# EAGLE schematic A-FINAL_SCHEMATIC (EAGLE 9.6.2)
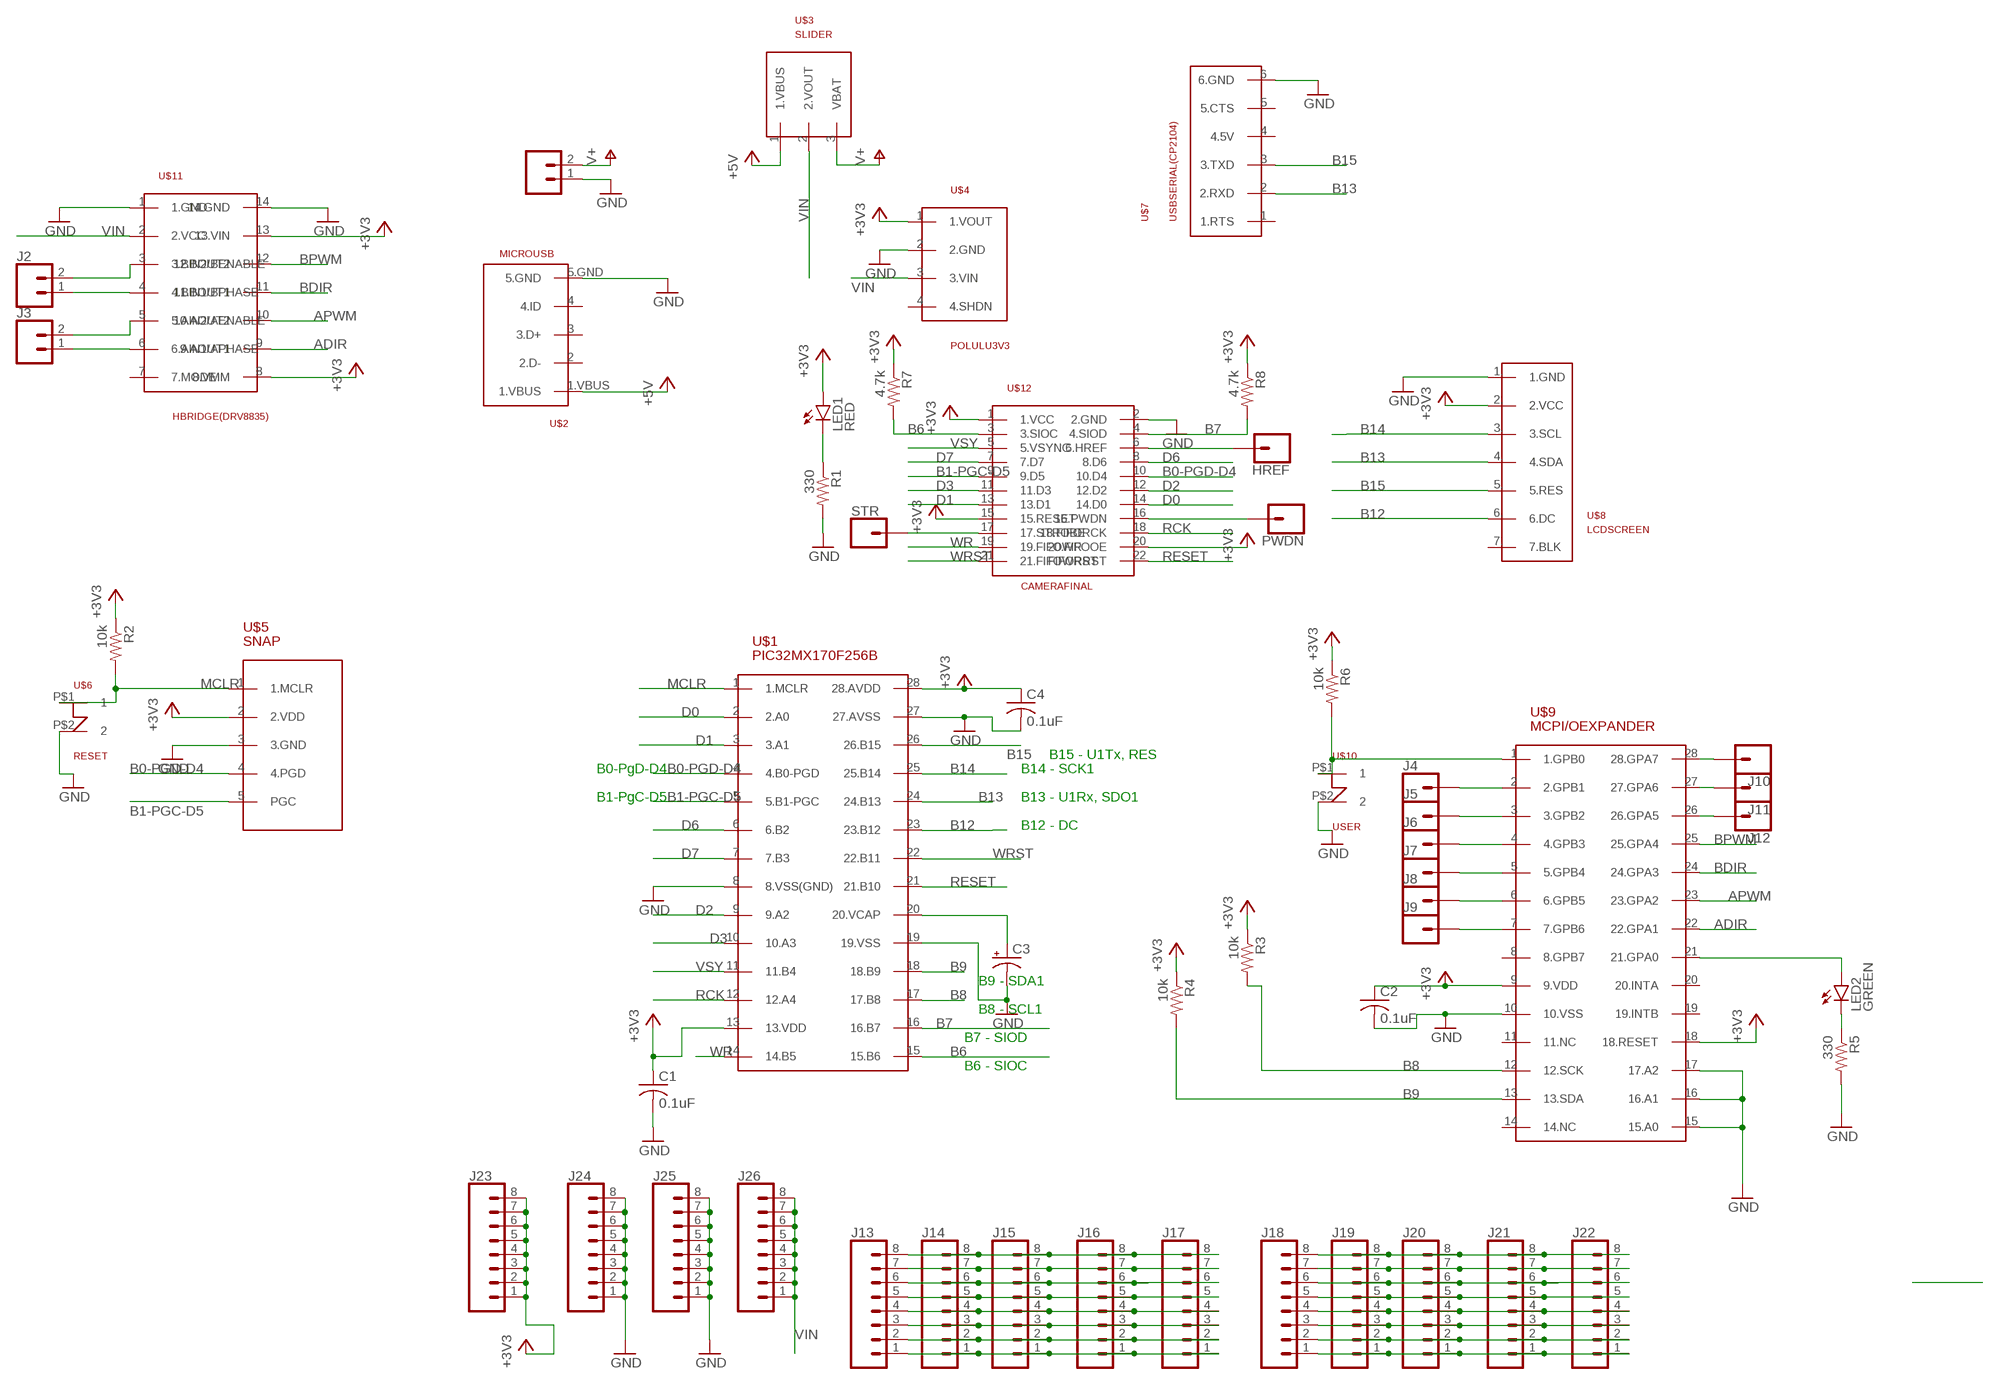
[diagram p0: schematic, sheet 1]

## Parts
C1  0.1uF  C-US025-030X050  [C025-030X050]
C2  0.1uF  C-US025-030X050  [C025-030X050]
C3  CPOL-USB45181B  [B45181B]
C4  0.1uF  C-US025-030X050  [C025-030X050]
HREF  CONN_01  [1X01]
J1  CONN_02-JST-2-PTH-NO_SILK  [JST-2-PTH-NS]
J2  CONN_02  [1X02]
J3  CONN_02  [1X02]
J4  CONN_01  [1X01]
J5  CONN_01  [1X01]
J6  CONN_01  [1X01]
J7  CONN_01  [1X01]
J8  CONN_01  [1X01]
J9  CONN_01  [1X01]
J10  CONN_01  [1X01]
J11  CONN_01  [1X01]
J12  CONN_01  [1X01]
J13  CONN_08"  [1X08]
J14  CONN_08"  [1X08]
J15  CONN_08"  [1X08]
J16  CONN_08"  [1X08]
J17  CONN_08"  [1X08]
J18  CONN_08"  [1X08]
J19  CONN_08"  [1X08]
J20  CONN_08"  [1X08]
J21  CONN_08"  [1X08]
J22  CONN_08"  [1X08]
J23  CONN_08"  [1X08]
J24  CONN_08"  [1X08]
J25  CONN_08"  [1X08]
J26  CONN_08"  [1X08]
LED1  RED  LED3MM  [LED3MM]
LED2  GREEN  LED3MM  [LED3MM]
PWDN  CONN_01  [1X01]
R1  330  R-US_0207/10  [0207/10]
R2  10k  R-US_0207/10  [0207/10]
R3  10k  R-US_0207/10  [0207/10]
R4  10k  R-US_0207/10  [0207/10]
R5  330  R-US_0207/10  [0207/10]
R6  10k  R-US_0207/10  [0207/10]
R7  4.7k  R-US_0207/10  [0207/10]
R8  4.7k  R-US_0207/10  [0207/10]
STR  CONN_01  [1X01]
U$1  PIC32MX170F256B  [DIL28-3]
U$2  MICROUSB  [MICROUSB]
U$3  SLIDER  [SLIDE]
U$4  POLULU3V3  [POLULU3V3]
U$5  SNAP  [1X05]
U$6  RESET  PUSH  [PUSH]
U$7  USBSERIAL(CP2104)  [USBSERIAL(CP2104)]
U$8  LCDSCREEN  [LCDSCREEN]
U$9  MCPI/OEXPANDER  [MCPI/OEXPANDER]
U$10  USER  PUSH  [PUSH]
U$11  HBRIDGE(DRV8835)  [HBRIDGE(DRV8835)]
U$12  CAMERAFINAL  [CAMERA_FINAL]

## Nets
+3V3: C1.1 C2.1 C4.1 J23.1 J23.2 J23.3 J23.4 J23.5 J23.6 J23.7 J23.8 LED1.A R2.1 R3.1 R4.1 R6.1 R7.1 R8.1 U$1.13(13.VDD) U$1.28(28.AVDD) U$4.1(1.VOUT) U$5.2(2.VDD) U$8.2.(2.VCC) U$9.9(9.VDD) U$9.18(18.RESET) U$11.8(8.VMM) U$11.13(13.VIN) U$12.1(1.VCC) U$12.15(15.RESET) U$12.20(20.FIFOOE)
+5V: U$2.1.VBUS U$3.1(1.VBUS)
ADIR: U$9.22(22.GPA1) U$11.9(9.AOUT1)
APWM: U$9.23(23.GPA2) U$11.10(10.AOUT2)
B0-PGD-D4: U$1.4(4.B0-PGD) U$5.4(4.PGD) U$12.10(10.D4)
B1-PGC-D5: U$1.5(5.B1-PGC) U$5.5(PGC) U$12.9(9.D5)
B6: R7.2 U$1.15(15.B6) U$12.3(3.SIOC)
B7: R8.2 U$1.16(16.B7) U$12.4(4.SIOD)
B8: R3.2 U$1.17(17.B8) U$9.12(12.SCK)
B9: R4.2 U$1.18(18.B9) U$9.13(13.SDA)
B12: U$1.23(23.B12) U$8.6.(6.DC)
B13: U$1.24(24.B13) U$7.2(2.RXD) U$8.4.(4.SDA)
B14: U$1.25(25.B14) U$8.3.(3.SCL)
B15: U$1.26(26.B15) U$7.3(3.TXD) U$8.5.(5.RES)
BDIR: U$9.24(24.GPA3) U$11.11(11.BOUT1)
BPWM: U$9.25(25.GPA4) U$11.12(12.BOUT2)
D0: U$1.2(2.A0) U$12.14(14.D0)
D1: U$1.3(3.A1) U$12.13(13.D1)
D2: U$1.9(9.A2) U$12.12(12.D2)
D3: U$1.10(10.A3) U$12.11(11.D3)
D6: U$1.6(6.B2) U$12.8(8.D6)
D7: U$1.7(7.B3) U$12.7(7.D7)
GND: C1.2 C2.2 C3.- C4.2 J1.1 J24.1 J24.2 J24.3 J24.4 J24.5 J24.6 J24.7 J24.8 J25.1 J25.2 J25.3 J25.4 J25.5 J25.6 J25.7 J25.8 R1.2 R5.2 U$1.8(8.VSS(GND)) U$1.19(19.VSS) U$1.27(27.AVSS) U$2.5.GND U$4.2(2.GND) U$5.3(3.GND) U$6.P$2 U$7.6(6.GND) U$8.1.(1.GND) U$9.10(10.VSS) U$9.15(15.A0) U$9.16(16.A1) U$9.17(17.A2) U$10.P$2 U$11.1(1.GND) U$11.14(14.GND) U$12.2(2.GND)
MCLR: R2.2 U$1.1(1.MCLR) U$5.1(1.MCLR) U$6.P$1
N$1: LED1.K(C) R1.1
N$2: LED2.A U$9.21(21.GPA0)
N$3: C3.+ U$1.20(20.VCAP)
N$4: LED2.K(C) R5.1
N$5: R6.2 U$9.1(1.GPB0) U$10.P$1
N$6: J2.2 U$11.3(3.BIN2/BENABLE)
N$7: J2.1 U$11.4(4.BIN1/BPHASE)
N$8: J3.2 U$11.5(5.AIN2/AENABLE)
N$9: J3.1 U$11.6(6.AIN1/APHASE)
N$10: HREF.1 U$12.6(6.HREF)
N$11: PWDN.1 U$12.16(16.PWDN)
N$12: STR.1 U$12.17(17.STROBE)
N$13: J4.1 U$9.2(2.GPB1)
N$14: J5.1 U$9.3(3.GPB2)
N$15: J6.1 U$9.4(4.GPB3)
N$16: J7.1 U$9.5(5.GPB4)
N$17: J8.1 U$9.6(6.GPB5)
N$18: J9.1 U$9.7(7.GPB6)
N$19: J10.1 U$9.28(28.GPA7)
N$20: J11.1 U$9.27(27.GPA6)
N$21: J12.1 U$9.26(26.GPA5)
N$22: J18.8 J19.8 J20.8 J21.8 J22.8
N$23: J13.8 J14.8 J15.8 J16.8 J17.8
N$24: J18.7 J19.7 J20.7 J21.7 J22.7
N$25: J18.6 J19.6 J20.6 J21.6 J22.6
N$26: J18.5 J19.5 J20.5 J21.5 J22.5
N$27: J18.4 J19.4 J20.4 J21.4 J22.4
N$28: J18.3 J19.3 J20.3 J21.3 J22.3
N$29: J18.2 J19.2 J20.2 J21.2 J22.2
N$30: J18.1 J19.1 J20.1 J21.1 J22.1
N$31: J13.7 J14.7 J15.7 J16.7 J17.7
N$32: J13.6 J14.6 J15.6 J16.6 J17.6
N$33: J13.5 J14.5 J15.5 J16.5 J17.5
N$34: J13.4 J14.4 J15.4 J16.4 J17.4
N$35: J13.3 J14.3 J15.3 J16.3 J17.3
N$36: J13.2 J14.2 J15.2 J16.2 J17.2
N$37: J13.1 J14.1 J15.1 J16.1 J17.1
RCK: U$1.12(12.A4) U$12.18(18.FIFORCK)
RESET: U$1.21(21.B10) U$12.22(FIFORRST)
V+: J1.2 U$3.3(VBAT)
VIN: J26.1 J26.2 J26.3 J26.4 J26.5 J26.6 J26.7 J26.8 U$3.2(2.VOUT) U$4.3(3.VIN) U$11.2(2.VCC)
VSY: U$1.11(11.B4) U$12.5(5.VSYNC)
WR: U$1.14(14.B5) U$12.19(19.FIFOWR)
WRST: U$1.22(22.B11) U$12.21(21.FIFOWRST)
Unconnected: U$2.2(2.D-) U$2.3(3.D+) U$2.4(4.ID) U$4.4(4.SHDN) U$7.1(1.RTS) U$7.4(4.5V) U$7.5(5.CTS) U$8.7.(7.BLK) U$9.8(8.GPB7) U$9.11(11.NC) U$9.14(14.NC) U$9.19(19.INTB) U$9.20(20.INTA) U$11.7(7.MODE)

## Notes on the sheet
- B15 - U1Tx, RES
- B0-PgD-D4 | B14 - SCK1
- B1-PgC-D5 | B13 - U1Rx, SDO1
- B12 - DC
- B9 - SDA1
- B8 - SCL1
- B7 - SIOD
- B6 - SIOC

## Library data of the parts
C1 C2 C4 = LIBRARY:C-US: CAPACITOR, American symbol; SPICEPREFIX: C
C3 = rcl:CPOL-US: POLARIZED CAPACITOR, American symbol; SPICEPREFIX: C
HREF J4-J12 PWDN STR = LIBRARY:CONN_01: Single connection point. Often used as Generic Header-pin footprint for 0.1 inch spaced/style header connections On any of the 0.1 inch spaced packages, you can populate with these: Break Away Headers - Straight <https://www.sparkfun.com/products/116> (PRT-00116) Break Away Male Headers - Right Angle <https://www.sparkfun.com/products/553> (PRT-00553) Female Headers <https://www.sparkfun.com/products/115> (PRT-00115) Break Away Headers - Machine Pin <https://www.sparkfun.com/products/117> (PRT-00117) Break Away Female Headers - Swiss Machine Pin <https://www.sparkfun.com/products/743> (PRT-00743) This device is also useful as a general connection point to wire up your design to another part of your project. Our various solder wires solder well into these plated through hole pads. Hook-Up Wire - Assortment (Stranded, 22 AWG) <https://www.sparkfun.com/products/11375> (PRT-11375) Hook-Up Wire - Assortment (Solid Core, 22 AWG) <https://www.sparkfun.com/products/11367> (PRT-11367) View the entire wire category on our website here <https://www.sparkfun.com/categories/141> Special notes: SMTSO-256-ET is a "flush mount" nut for a 4-40 screw. We mostly use this on specialty testbeds; it is a nice way to connect hardware to your PCB at an adjustable hieght. Also note, the SNAP packages are for using a snappable style connector. We sell a baggie of snaps and they are also used on two LilyPad designs: Snap Assortment - 30 pack (male and female) <https://www.sparkfun.com/products/11347> (DEV-11347) LilyPad Arduino SimpleSnap <https://www.sparkfun.com/products/10941> (DEV-10941) LilyPad SimpleSnap Protoboard <https://www.sparkfun.com/products/10940> (DEV-10940)
J1-J3 = LIBRARY:CONN_02: Multi connection point. Often used as Generic Header-pin footprint for 0.1 inch spaced/style header connections On any of the 0.1 inch spaced packages, you can populate with these: Break Away Headers - Straight <https://www.sparkfun.com/products/116> (PRT-00116) Break Away Male Headers - Right Angle <https://www.sparkfun.com/products/553> (PRT-00553) Female Headers <https://www.sparkfun.com/products/115> (PRT-00115) Break Away Headers - Machine Pin <https://www.sparkfun.com/products/117> (PRT-00117) Break Away Female Headers - Swiss Machine Pin <https://www.sparkfun.com/products/743> (PRT-00743) For SCREWTERMINALS and SPRING TERMINALS visit here: Screw Terimnals on SparkFun.com <https://www.sparkfun.com/search/results?term=Screw+Terminals> (5mm/3.5mm/2.54mm spacing) This device is also useful as a general connection point to wire up your design to another part of your project. Our various solder wires solder well into these plated through hole pads. Hook-Up Wire - Assortment (Stranded, 22 AWG) <https://www.sparkfun.com/products/11375> (PRT-11375) Hook-Up Wire - Assortment (Solid Core, 22 AWG) <https://www.sparkfun.com/products/11367> (PRT-11367) View the entire wire category on our website here <https://www.sparkfun.com/categories/141> Special notes: Molex polarized connector foot print use with: PRT-08233 with associated crimp pins and housings. 2.54_SCREWTERM for use with PRT-10571. 3.5mm Screw Terminal footprints for PRT-08084 5mm Screw Terminal footprints for use with PRT-08432
J13-J26 = LIBRARY:CONN_08: Multi connection point. Often used as Generic Header-pin footprint for 0.1 inch spaced/style header connections On any of the 0.1 inch spaced packages, you can populate with these: Break Away Headers - Straight <https://www.sparkfun.com/products/116> (PRT-00116) Break Away Male Headers - Right Angle <https://www.sparkfun.com/products/553> (PRT-00553) Female Headers <https://www.sparkfun.com/products/115> (PRT-00115) Break Away Headers - Machine Pin <https://www.sparkfun.com/products/117> (PRT-00117) Break Away Female Headers - Swiss Machine Pin <https://www.sparkfun.com/products/743> (PRT-00743) Arduino Stackable Header - 8 Pin <https://www.sparkfun.com/products/9279> (PRT-09279) For SCREWTERMINALS and SPRING TERMINALS visit here: Screw Terimnals on SparkFun.com <https://www.sparkfun.com/search/results?term=Screw+Terminals> (5mm/3.5mm/2.54mm spacing) This device is also useful as a general connection point to wire up your design to another part of your project. Our various solder wires solder well into these plated through hole pads. Hook-Up Wire - Assortment (Stranded, 22 AWG) <https://www.sparkfun.com/products/11375> (PRT-11375) Hook-Up Wire - Assortment (Solid Core, 22 AWG) <https://www.sparkfun.com/products/11367> (PRT-11367) View the entire wire category on our website here <https://www.sparkfun.com/categories/141> Special notes: Molex polarized connector foot print use with SKU : PRT-08231 with associated crimp pins and housings. 1MM SMD Version SKU: PRT-10208 NOTES ON THE VARIANTS LOCK and LOCK_LONGPADS... This footprint was designed to help hold the alignment of a through-hole component (i.e. 6-pin header) while soldering it into place. You may notice that each hole has been shifted either up or down by 0.005 of an inch from it's more standard position (which is a perfectly straight line). This slight alteration caused the pins (the squares in the middle) to touch the edges of the holes. Because they are alternating, it causes a "brace" to hold the component in place. 0.005 has proven to be the perfect amount of "off-center" position when using our standard breakaway headers. Although looks a little odd when you look at the bare footprint, once you have a header in there, the alteration is very hard to notice. Also,if you push a header all the way into place, it is covered up entirely on the bottom side.; PROD_ID: CONN-08438
LED1 LED2 = LIBRARY:LED: LED OSRAM: - CHIPLED LG R971, LG N971, LY N971, LG Q971, LY Q971, LO R971, LY R971 LH N974, LH R974 LS Q976, LO Q976, LY Q976 LO Q996 - Hyper CHIPLED LW Q18S LB Q993, LB Q99A, LB R99A - SideLED LS A670, LO A670, LY A670, LG A670, LP A670 LB A673, LV A673, LT A673, LW A673 LH A674 LY A675 LS A676, LA A676, LO A676, LY A676, LW A676 LS A679, LY A679, LG A679 - Hyper Micro SIDELED® LS Y876, LA Y876, LO Y876, LY Y876 LT Y87S - SmartLED LW L88C, LW L88S LB L89C, LB L89S, LG L890 LS L89K, LO L89K, LY L89K LS L896, LA L896, LO L896, LY L896 - TOPLED LS T670, LO T670, LY T670, LG T670, LP T670 LSG T670, LSP T670, LSY T670, LOP T670, LYG T670 LG T671, LOG T671, LSG T671 LB T673, LV T673, LT T673, LW T673 LH T674 LS T676, LA T676, LO T676, LY T676, LB T676, LH T676, LSB T676, LW T676 LB T67C, LV T67C, LT T67C, LS T67K, LO T67K, LY T67K, LW E67C LS E67B, LA E67B, LO E67B, LY E67B, LB E67C, LV E67C, LT E67C LW T67C LS T679, LY T679, LG T679 LS T770, LO T770, LY T770, LG T770, LP T770 LB T773, LV T773, LT T773, LW T773 LH T774 LS E675, LA E675, LY E675, LS T675 LS T776, LA T776, LO T776, LY T776, LB T776 LHGB T686 LT T68C, LB T68C - Hyper Mini TOPLED® LB M676 - Mini TOPLED Santana® LG M470 LS M47K, LO M47K, LY M47K Source: http://www.osram.convergy.de LUXEON: - LUMILED® LXK2-PW12-R00, LXK2-PW12-S00, LXK2-PW14-U00, LXK2-PW14-V00 LXK2-PM12-R00, LXK2-PM12-S00, LXK2-PM14-U00 LXK2-PE12-Q00, LXK2-PE12-R00, LXK2-PE12-S00, LXK2-PE14-T00, LXK2-PE14-U00 LXK2-PB12-K00, LXK2-PB12-L00, LXK2-PB12-M00, LXK2-PB14-N00, LXK2-PB14-P00, LXK2-PB14-Q00 LXK2-PR12-L00, LXK2-PR12-M00, LXK2-PR14-Q00, LXK2-PR14-R00 LXK2-PD12-Q00, LXK2-PD12-R00, LXK2-PD12-S00 LXK2-PH12-R00, LXK2-PH12-S00 LXK2-PL12-P00, LXK2-PL12-Q00, LXK2-PL12-R00 Source: www.luxeon.com KINGBRIGHT: KA-3528ASYC Source: www.kingbright.com
R1-R8 = LIBRARY:R-US_: RESISTOR, American symbol; SPICEPREFIX: R
U$1 = LIBRARY:PIC32MX170F256B
U$2 = LIBRARY:MICROUSB
U$3 = LIBRARY:SLIDER
U$4 = LIBRARY:POLULU3V3
U$5 = LIBRARY:SNAP
U$6 U$10 = LIBRARY:PUSH
U$7 = LIBRARY:USBSERIAL(CP2104)
U$8 = LIBRARY:LCDSCREEN
U$9 = LIBRARY:MCPI/OEXPANDER
U$11 = LIBRARY:HBRIDGE(DRV8835)
U$12 = LIBRARY:CAMERA